# Altium schematic sheet usb.SchDoc
size A4; SheetNumber: 4; SheetTotal: 6
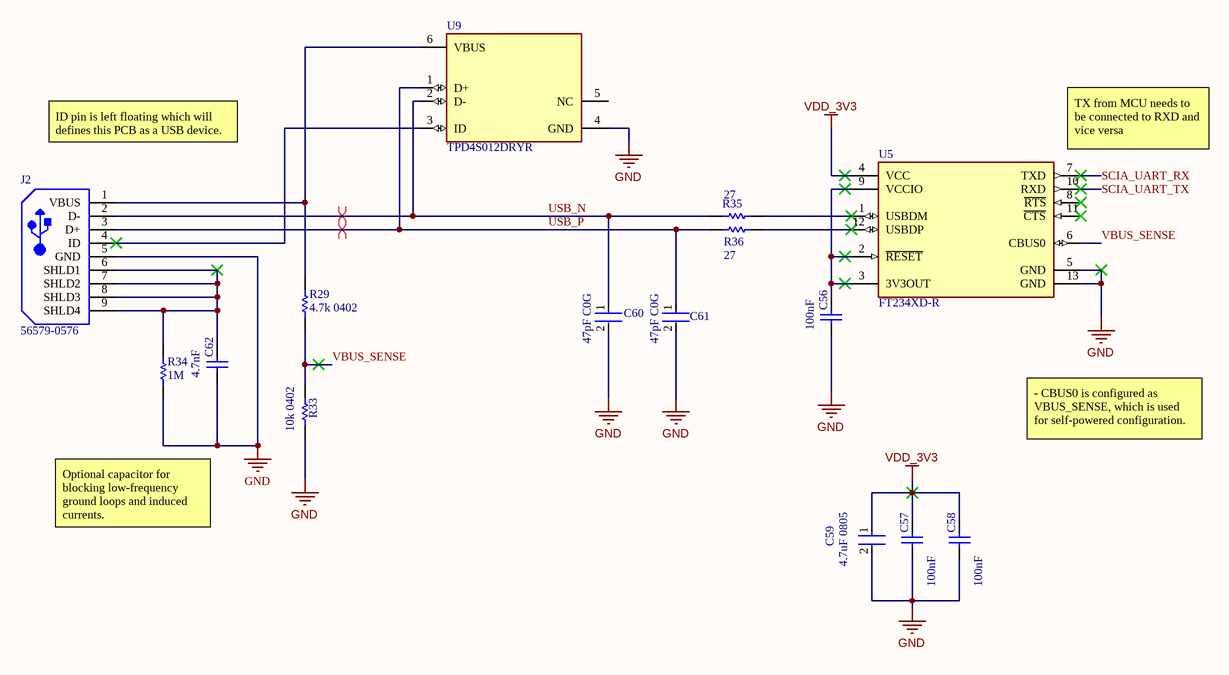
[diagram p0: usb.SchDoc]

## Parts
C56  100nF  [CAP 0402_1005]
C57  100nF  [CAP 0402_1005]
C58  100nF  [CAP 0402_1005]
C59  4.7uF 0805  [FP-C0805C475K8PACTU-MFG]
C60  47pF C0G  [FP-C0402-BB-MFG]
C61  47pF C0G  [FP-C0402-BB-MFG]
C62  4.7nF  [CAP 0603_1608]
J2  56579-0576  [MOLX-56579-0576_V]
R29  4.7k 0402  [RES 0402_1005 RF]
R33  10k 0402  [RES 0402_1005]
R34  1M  [RES 0402_1005]
R35  27  [RES 0402_1005]
R36  27  [RES 0402_1005]
U5  FT234XD-R  [FP-DFN-12-IPC_B]
U9  TPD4S012DRYR  [FP-DRY0006A-MFG]

## Nets
GND: C56.1 C57.1 C58.1 C59.2 C60.2 C61.2 C62.1 J2.5(GND) R33.1 R34.2 U5.5(GND) U5.13(GND) U9.4(GND)
VDD_3V3: C57.2 C58.2 C59.1 U5.4(VCC)
SCIA_UART_RX: U5.7(TXD)
SCIA_UART_TX: U5.10(RXD)
USB_N: C60.1 J2.2(D-) R35.1 U9.2(D-)
USB_P: C61.1 J2.3(D+) R36.1 U9.1(D+)
VBUS_SENSE: R29.2 R33.2 U5.6(CBUS0)
NetC56_2: C56.2 U5.2(~{RESET}) U5.3(3V3OUT) U5.9(VCCIO)
NetC62_2: C62.2 J2.6(SHLD1) J2.7(SHLD2) J2.8(SHLD3) J2.9(SHLD4) R34.1
NetJ2_1: J2.1(VBUS) R29.1 U9.6(VBUS)
NetJ2_4: J2.4(ID) U9.3(ID)
NetR35_2: R35.2 U5.1(USBDM)
NetR36_2: R36.2 U5.12(USBDP)

Not connected (* = marked no-connect by the designer): U5 8(~{RTS})* 11(~{CTS})*; U9 5(NC)

## Layout directives
differential pair: USB_N, USB_P

## Notes on the sheet
- ID pin is left floating which will defines this PCB as a USB device.
- (near U5) TX from MCU needs to be connected to RXD and vice versa
- - CBUS0 is configured as VBUS_SENSE, which is used for self-powered configuration.
- Optional capacitor for blocking low-frequency ground loops and induced currents.

## Library data of the parts
C56-C58 = Cap: MLCC 100nF 0402 10V; Published: 8-Jun-2000; LatestRevisionDate: 17-Jul-2002; LatestRevisionNote: Re-released for DXP Platform.; PackageReference: RAD-0.3; Publisher: Altium Limited; PackageDescription: Radial Cap, Thru-Hole; 2 Leads; 0.3 in Pin Spacing; Value: 100nF; Supplier 1: Arrow Electronics; Supplier Part Number 1: C0402C104K8PACTU
C59 = CMP-2007-01007-2: CAP CER 4.7UF 10V X5R 0805; Dielectric Material: Ceramic; Dissipation Factor: 5%; Tolerance: 10%; Lead Pitch: 0.75mm; Mount: Surface Mount; Voltage Rating (DC): 10V; Length: 2mm; Case Code (Imperial): 0805; Height: 1.25mm; Package Quantity: 1; Thickness: 0.055inch; Depth: 1.25mm; Case Code (Metric): 2012; Termination: SMD/SMT; Construction: Flat; Dielectric: X5R; Series: C; Capacitance: 4.7uF; Width: 1.2mm; Max Operating Temperature: 85°C; Packaging: Tape and Reel; Voltage Rating: 10V; REACH SVHC: No SVHC; Min Operating Temperature: -55°C; Number of Pins: 2; Case/Package: 0805; Radiation Hardening: No; Lead Free: Lead Free; Voltage: 10V; RoHS Compliant: Yes
C60 C61 = CMP-2008-03283-3: MLCC 47pF 0402 10V C0G; Voltage: 50V; Temperature Coefficient: 30ppm/°C; Dielectric Material: Ceramic; Tolerance: 5%; Length: 1mm; Height: 0.5mm; Lead Free: Lead Free; Lead Pitch: 0.3mm; Width: 0.02inch; Min Operating Temperature: -55°C; Case Code (Imperial): 0402; Package Quantity: 1; Contact Plating: Tin; Series: C; Depth: 0.5mm; Dielectric: C0G; Termination: SMD/SMT; REACH SVHC: No SVHC; Number of Pins: 2; Construction: Flat; RoHS Compliant: Yes; Capacitance: 47pF; Thickness: 0.022inch; Radiation Hardening: No; Case/Package: 0402; Voltage Rating (DC): 50V; Voltage Rating: 50V; Max Operating Temperature: 125°C; Packaging: Tape and Reel; Case Code (Metric): 1005; Mount: Surface Mount
C62 = Cap: MLCC 4.7nF 0603 10V; Published: 8-Jun-2000; LatestRevisionDate: 17-Jul-2002; LatestRevisionNote: Re-released for DXP Platform.; PackageReference: RAD-0.3; Publisher: Altium Limited; PackageDescription: Radial Cap, Thru-Hole; 2 Leads; 0.3 in Pin Spacing; Value: 4.7nF
J2 = CMP-2000-05643-1: USB Connector, 30 V, 1 A, 0 to 50 degC, 5-Pin SMD, RoHS, Tape and Reel; Brand: Molex; Insulation Resistance: 100MOhms; Connector Type: MiniUSBTypeABReceptacle; Mounting Angle: Right; Number of Ports: 1Port; Gender: Female; Voltage Rating: 30VAC/DC; Number of Contacts: 5Contact; Current Rating: 1A; Package Reference: 56579-0576; Package Description: 5-Pin Surface Mount Device, Body 9.9 x 9 mm, Pitch 0.8 mm; Color: Gray; Manufacturer URL: http://www.molex.com/; Product: MiniUSBTypeABConnectors; Factory Pack Quantity: 800; Standard: USB; Termination Style: SolderTab; Contact Plating: Gold; Product Category: USBConnectors; Datasheet Version: Rev. E, 04/2006; Operating Temperature Range: 0Cto+50C; RoHS: Details; Manufacturer: Molex; Features: MetalshieldingforESDprotection; Mounting Technology: SurfaceMount; Flammability Rating: UL94V-0; Datasheet URL: http://www.molex.com/pdm_docs/sd/565790576_sd.pdf; Series: 56579; Contact Material: CopperAlloy; Packaging: Reel
R29 = Res1: Resistor 4.7kOhm 0402; Published: 8-Jun-2000; LatestRevisionDate: 17-Jul-2002; LatestRevisionNote: Re-released for DXP Platform.; PackageReference: AXIAL-0.3; Publisher: Altium Limited; PackageDescription: Axial Device, Thru-Hole; 2 Leads; 0.3 in Pin Spacing; Value: 4.7k
R33 = Res1: Resistor 10kOhm 0402; Published: 8-Jun-2000; LatestRevisionDate: 17-Jul-2002; LatestRevisionNote: Re-released for DXP Platform.; PackageReference: AXIAL-0.3; Publisher: Altium Limited; PackageDescription: Axial Device, Thru-Hole; 2 Leads; 0.3 in Pin Spacing; Value: 10k
R34 = Res1: Resistor 1MOhm 0402; Published: 8-Jun-2000; LatestRevisionDate: 17-Jul-2002; LatestRevisionNote: Re-released for DXP Platform.; PackageReference: AXIAL-0.3; Publisher: Altium Limited; PackageDescription: Axial Device, Thru-Hole; 2 Leads; 0.3 in Pin Spacing; Value: 1M; Supplier 1: Arrow Electronics; Supplier Part Number 1: CRGCQ0402F1M0
R35 R36 = Res1: Resistor 27Ohm 0402; Published: 8-Jun-2000; LatestRevisionDate: 17-Jul-2002; LatestRevisionNote: Re-released for DXP Platform.; PackageReference: AXIAL-0.3; Publisher: Altium Limited; PackageDescription: Axial Device, Thru-Hole; 2 Leads; 0.3 in Pin Spacing; Value: 27; Supplier 1: Digikey; Supplier Part Number 1: YAG3086CT-ND
U5 = CMP-0248-00027-3: IC USB SERIAL BASIC UART 12DFN; Min Supply Voltage: 2.97V; Number of Ports: 1; Operating Supply Voltage: 5V; Operating Supply Current: 8mA; Max Supply Voltage: 5.5V; Data Rate: 3Mbps; Length: 3mm; Case/Package: DFN; Mount: Surface Mount; Packaging: Tape and Reel; Max Operating Temperature: 85°C; Height: 0.75mm; Number of Pins: 12; Number of Transceivers: 1; Package Quantity: 5000; Min Operating Temperature: -40°C; Width: 3mm; REACH SVHC: No SVHC; Interface: UART; Lead Free: Lead Free
U9 = CMP-0326-00038-4: TVS DIODE 5.5V 6SON; Breakdown Voltage: 24V; Interface: USB; ESD Protection: Yes; Peak Pulse Power: 60W; Number of Circuits: 4; Polarity: Unidirectional; Capacitance: 15pF; Test Current: 1mA; Working Voltage: 19V; Min Breakdown Voltage: 6V; Peak Pulse Current: 3A; Operating Supply Voltage: 950mV; Max Operating Temperature: 85°C; Packaging: Tape and Reel; Termination: SMD/SMT; Number of Pins: 6; Radiation Hardening: No; Width: 1.05mm; REACH SVHC: No SVHC; Lead Free: Lead Free; Depth: 1mm; Package Quantity: 5000; Length: 1.45mm; Direction: Unidirectional; Min Operating Temperature: -40°C; Number of Channels: 4; Max Power Dissipation: 60W; Height: 0.55mm